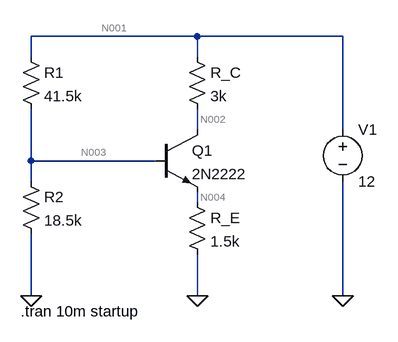
[diagram p0: schematic lab4prelab1.asc]
lab4prelab1.asc, the LTspice schematic file:
Version 4
SHEET 1 880 680
WIRE 192 -32 -64 -32
WIRE 416 -32 192 -32
WIRE -64 0 -64 -32
WIRE 192 0 192 -32
WIRE 192 112 192 80
WIRE 416 112 416 -32
WIRE -64 160 -64 80
WIRE 128 160 -64 160
WIRE -64 192 -64 160
WIRE 192 224 192 208
WIRE -64 368 -64 272
WIRE 192 368 192 304
WIRE 416 368 416 192
FLAG 416 368 0
FLAG -64 368 0
FLAG 192 368 0
SYMBOL npn 128 112 R0
SYMATTR InstName Q1
SYMATTR Value 2N2222
SYMBOL res 176 -16 R0
SYMATTR InstName R_C
SYMATTR Value 3k
SYMBOL res 176 208 R0
SYMATTR InstName R_E
SYMATTR Value 1.5k
SYMBOL voltage 416 96 R0
WINDOW 123 0 0 Left 0
WINDOW 39 0 0 Left 0
SYMATTR InstName V1
SYMATTR Value 12
SYMBOL res -80 -16 R0
SYMATTR InstName R1
SYMATTR Value 41.5k
SYMBOL res -80 176 R0
SYMATTR InstName R2
SYMATTR Value 18.5k
TEXT -80 392 Left 2 !.tran 10m startup

The netlist it stands for:
* lab4prelab1.asc
Q1 N002 N003 N004 0 2N2222
R_C N001 N002 3k
R_E N004 0 1.5k
V1 N001 0 12
R1 N001 N003 41.5k
R2 N003 0 18.5k
.model NPN NPN
.model PNP PNP
.lib standard.bjt
.tran 10m startup
.backanno
.end

* Results of the author's LTspice run, read from the files saved beside the schematic
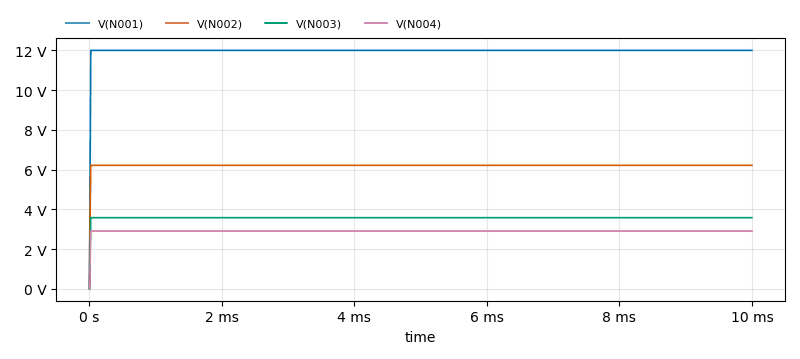
[diagram p1: Transient Analysis of lab4prelab1.asc, plotted from the saved traces]
* Transient Analysis, 1 run:
*   V(N001): min 0 V, max 12 V, average 11.99 V, rms 11.99 V, last 12 V
*   V(N002): min 0 V, max 6.214 V, average 6.209 V, rms 6.211 V, last 6.214 V
*   V(N003): min 0 V, max 3.582 V, average 3.576 V, rms 3.577 V, last 3.579 V
*   V(N004): min 0 V, max 2.909 V, average 2.904 V, rms 2.905 V, last 2.907 V